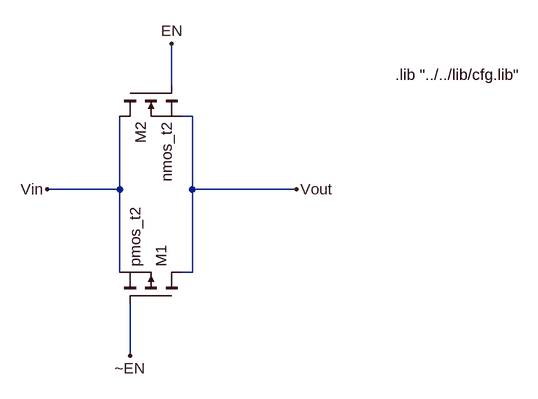
[diagram p0: schematic transmition_gate.asc]
transmition_gate.asc, the LTspice schematic file:
Version 4
SHEET 1 880 680
WIRE 160 16 160 -48
WIRE 192 64 176 64
WIRE 80 176 80 64
WIRE 80 176 -32 176
WIRE 192 176 192 64
WIRE 352 176 192 176
WIRE 80 304 80 176
WIRE 192 304 192 176
WIRE 192 304 176 304
WIRE 96 432 96 352
FLAG 352 176 Vout
FLAG -32 176 Vin
FLAG 160 -48 EN
FLAG 96 432 ~EN
SYMBOL pmos 176 352 M270
SYMATTR InstName M1
SYMATTR Value pmos_t2
SYMATTR Prefix X
SYMBOL nmos 80 16 M90
SYMATTR InstName M2
SYMATTR Value nmos_t2
SYMATTR Prefix X
TEXT 504 0 Left 2 !.lib "../../lib/cfg.lib"

The netlist it stands for:
* transmition_gate.asc
XM1 Vout ~EN Vin pmos_t2  ; pins D G S
XM2 Vin EN Vout nmos_t2  ; pins D G S
.lib "../../lib/cfg.lib"
.backanno
.end